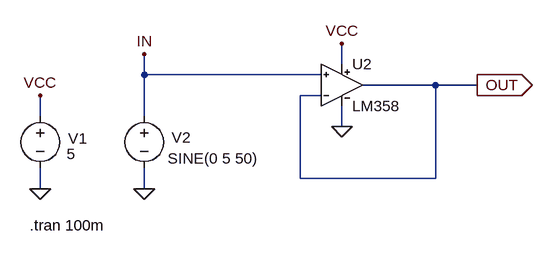
[diagram p0: schematic OpAmp_LM358.asc]
OpAmp_LM358.asc, the LTspice schematic file:
Version 4.1
SHEET 1 908 680
WIRE 576 64 576 32
WIRE 272 80 272 48
WIRE 544 80 272 80
WIRE 720 96 608 96
WIRE 784 96 720 96
WIRE 544 112 512 112
WIRE 112 144 112 112
WIRE 272 144 272 80
WIRE 576 160 576 128
WIRE 512 240 512 112
WIRE 720 240 720 96
WIRE 720 240 512 240
WIRE 112 256 112 224
WIRE 272 256 272 224
FLAG 112 256 0
FLAG 112 112 VCC
FLAG 272 256 0
FLAG 576 160 0
FLAG 576 32 VCC
FLAG 784 96 OUT
IOPIN 784 96 Out
FLAG 272 48 IN
SYMBOL voltage 112 128 R0
WINDOW 123 0 0 Left 0
WINDOW 39 0 0 Left 0
WINDOW 0 43 50 Left 2
WINDOW 3 41 74 Left 2
SYMATTR InstName V1
SYMATTR Value 5
SYMBOL voltage 272 128 R0
WINDOW 123 0 0 Left 0
WINDOW 39 0 0 Left 0
WINDOW 0 42 49 Left 2
WINDOW 3 36 81 Left 2
SYMATTR InstName V2
SYMATTR Value SINE(0 5 50)
SYMBOL sym\\MyLib\\OpAmp\\LM358 576 32 R0
SYMATTR InstName U2
TEXT 96 312 Left 2 !.tran 100m

The netlist it stands for:
* OpAmp_LM358.asc
V1 VCC 0 5
V2 IN 0 SINE(0 5 50)
X§U2 OUT IN OUT VCC 0 LM358  ; pins In- In+ OUT V+ V-
.tran 100m
.lib MyLib/OpAmp/LM358.lib
.backanno
.end

* Results of the author's LTspice run, read from the files saved beside the schematic
* Operating Point, zero values left out:
*   V(out) = 40.62 mV
*   V(vcc) = 5 V
*   I(V1) = -286.9 µA
*   I(V2) = 13.03 nA
*   Ix(u2:1) = -3.76 nA
*   Ix(u2:2) = -13.03 nA
*   Ix(u2:3) = 3.76 nA
*   Ix(u2:4) = 286.9 µA
*   Ix(u2:5) = -286.8 µA
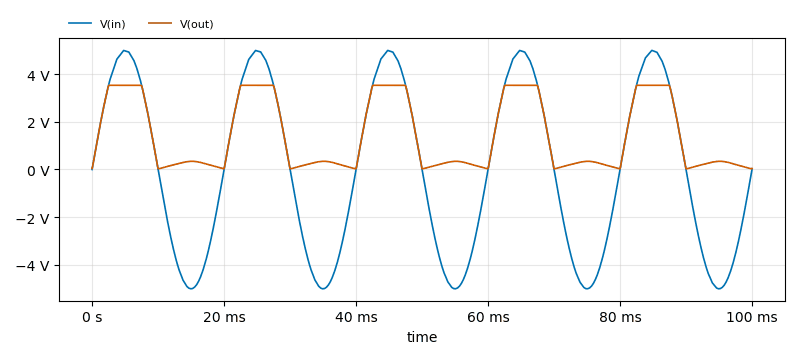
[diagram p1: Transient Analysis of OpAmp_LM358.asc, plotted from the saved traces]
* Transient Analysis, 1 run:
*   V(in): min -5 V, max 4.992 V, average -6.08 mV, rms 3.53 V, last 0 V
*   V(out): min 31.84 mV, max 3.529 V, average 1.449 V, rms 2.072 V, last 40.52 mV